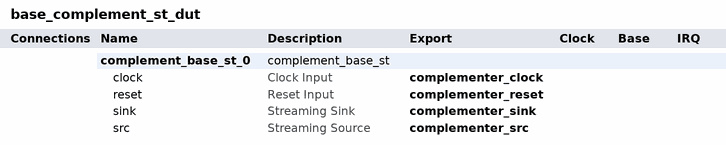
[diagram p0: system contents]
# Platform Designer (Qsys) system base_complement_st_dut, Cyclone V 5CSXFC6C6U23C8ES
# Parameters at their usual value, and those the tool derives, are not listed.
package require qsys
create_system base_complement_st_dut
set_project_property DEVICE_FAMILY {Cyclone V}
set_project_property DEVICE 5CSXFC6C6U23C8ES

add_instance complement_base_st_0 complement_base_st 1.0

# exported interfaces
add_interface complementer_reset reset sink
set_interface_property complementer_reset EXPORT_OF complement_base_st_0.reset
add_interface complementer_clock clock sink
set_interface_property complementer_clock EXPORT_OF complement_base_st_0.clock
add_interface complementer_src avalon_streaming source
set_interface_property complementer_src EXPORT_OF complement_base_st_0.src
add_interface complementer_sink avalon_streaming sink
set_interface_property complementer_sink EXPORT_OF complement_base_st_0.sink

set_interconnect_requirement {$system} qsys_mm.clockCrossingAdapter HANDSHAKE
set_interconnect_requirement {$system} qsys_mm.maxAdditionalLatency 1
set_interconnect_requirement {$system} qsys_mm.insertDefaultSlave false

save_system base_complement_st_dut.qsys
